# EAGLE schematic XMC4500_Relax-V1 (EAGLE 5.07)

## Sheet 1 of 2
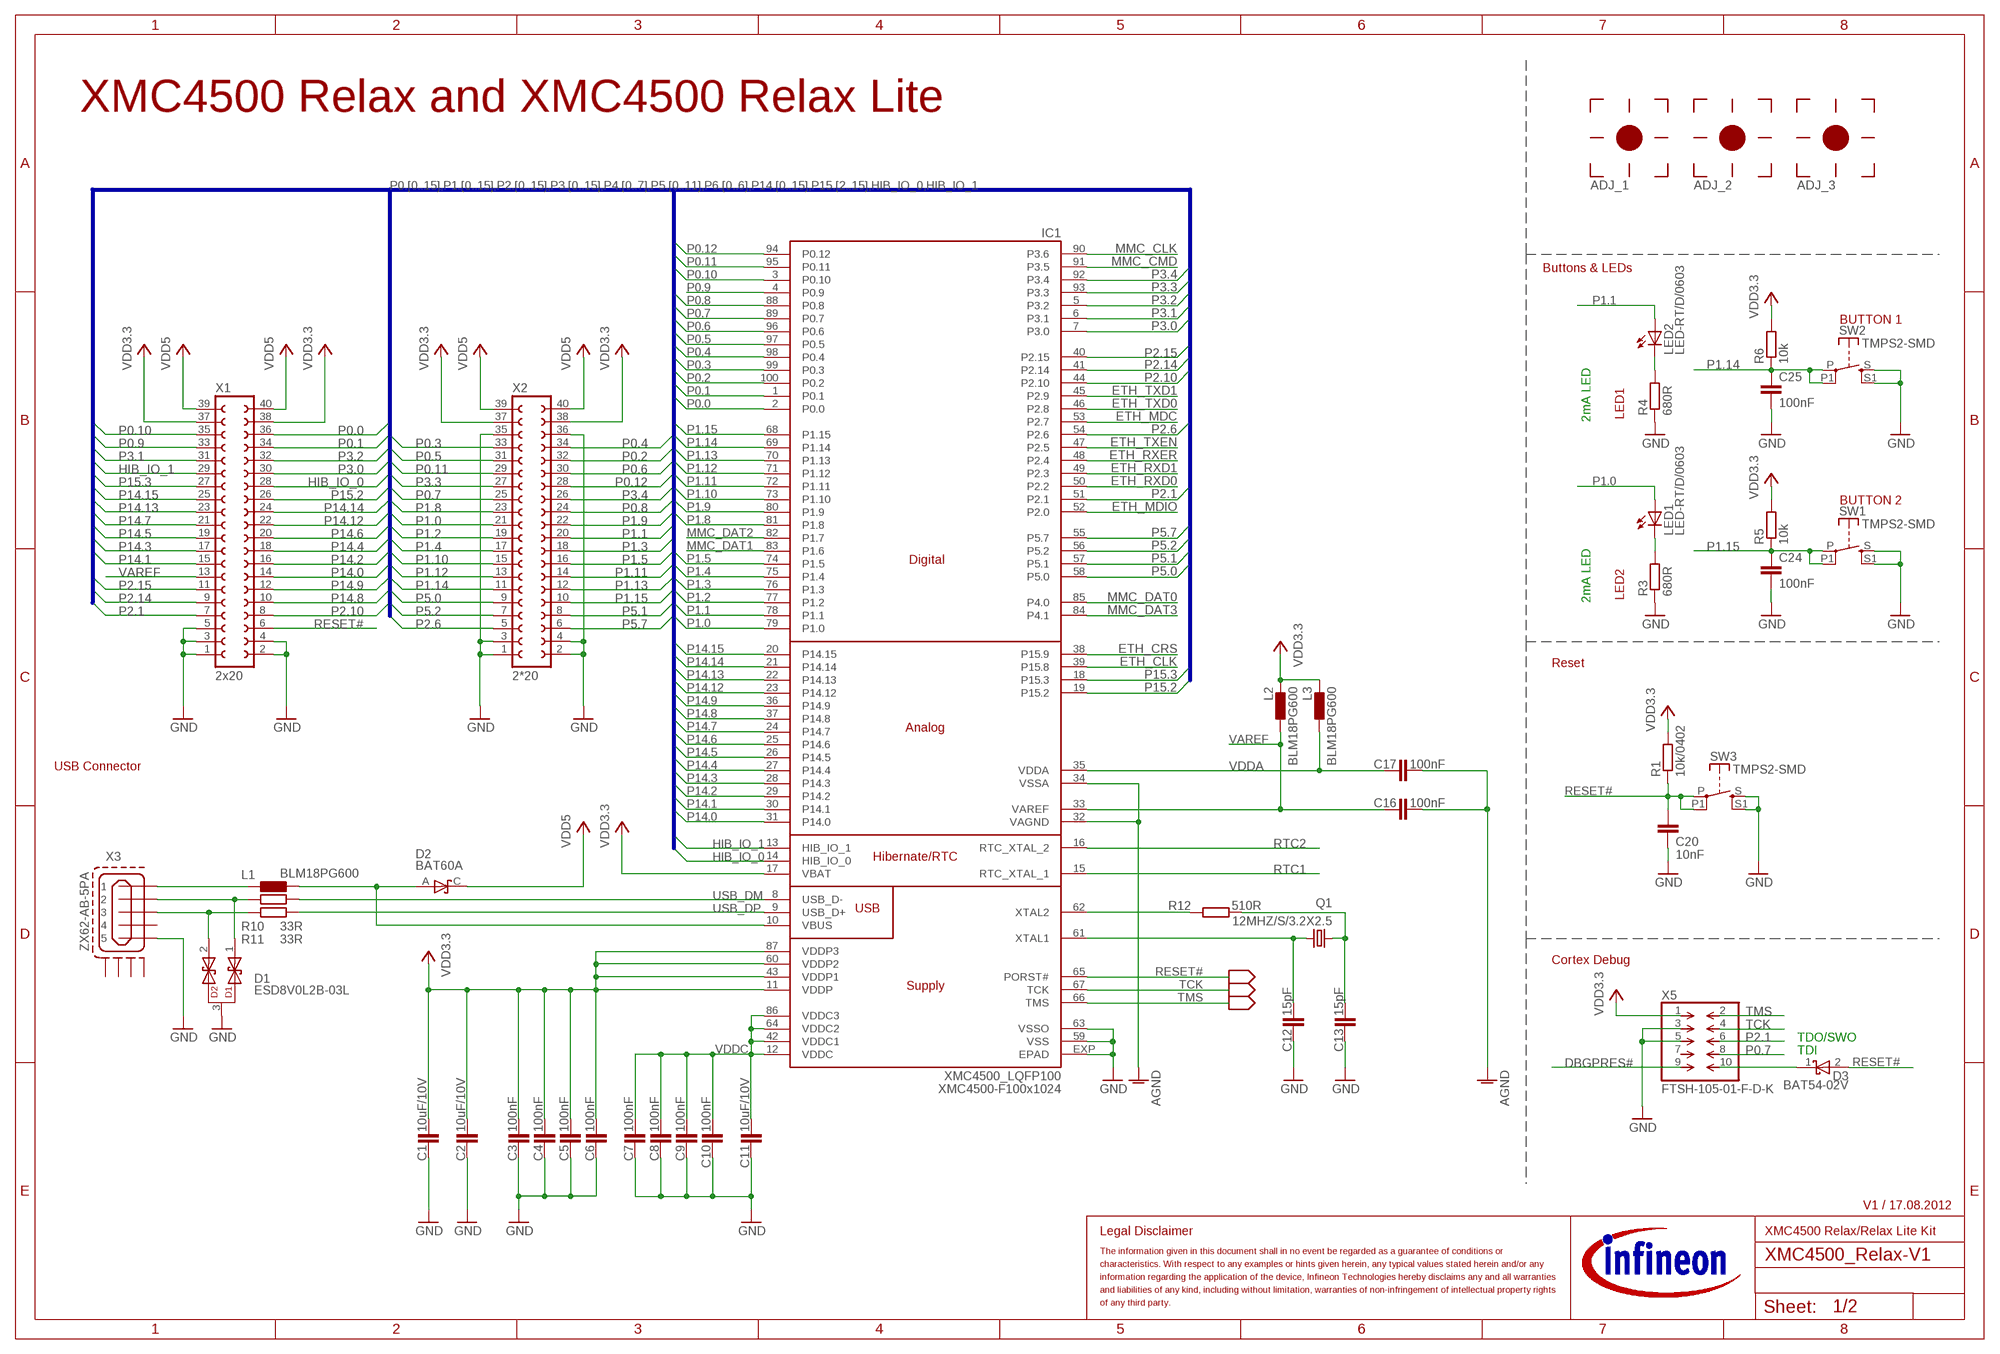
[diagram p0: schematic, sheet 1]

### Parts
ADJ_1  FIDUCIAL  [FIDUCIAL]
ADJ_2  FIDUCIAL  [FIDUCIAL]
ADJ_3  FIDUCIAL  [FIDUCIAL]
C1  10uF/10V  C-EUC0805K  [C0805K]
C2  10uF/10V  C-EUC0805K  [C0805K]
C3  100nF  C-EUC0402  [C0402]
C4  100nF  C-EUC0402  [C0402]
C5  100nF  C-EUC0402  [C0402]
C6  100nF  C-EUC0402  [C0402]
C7  100nF  C-EUC0402  [C0402]
C8  100nF  C-EUC0402  [C0402]
C9  100nF  C-EUC0402  [C0402]
C10  100nF  C-EUC0402  [C0402]
C11  10uF/10V  C-EUC0805K  [C0805K]
C12  15pF  C-EUC0402  [C0402]
C13  15pF  C-EUC0402  [C0402]
C16  100nF  C-EUC0402  [C0402]
C17  100nF  C-EUC0402  [C0402]
C20  10nF  C-EUC0402  [C0402]
C24  100nF  C-EUC0402  [C0402]
C25  100nF  C-EUC0402  [C0402]
D1  ESD8V0L2B-03L  [TSLP-3-1]
D2  BAT60A  BAT60  [SOD323-R]
D3  BAT54-02V  [SC79]
IC1  XMC4500_LQFP100  XMC4400_LQFP100  [P/PG-LQFP-100-11]
L1  BLM18PG600  L_EU_L0603  [L1608]
L2  BLM18PG600  L_EU_L0603  [L1608]
L3  BLM18PG600  L_EU_L0603  [L1608]
LED1  LED-RT/D/0603  LEDCHIPLED_0603  [CHIPLED_0603]
LED2  LED-RT/D/0603  LEDCHIPLED_0603  [CHIPLED_0603]
Q1  12MHZ/S/3.2X2.5  NX3225_2  [32X25_4PAD]
R1  10k/0402  R-EU_R0402  [R0402]
R3  680R  R-EU_R0603  [R0603]
R4  680R  R-EU_R0603  [R0603]
R5  10k  R-EU_R0402  [R0402]
R6  10k  R-EU_R0402  [R0402]
R10  33R  R-EU_R06030402  [R0402]
R11  33R  R-EU_R06030402  [R0402]
R12  510R  R-EU_R0603  [R0603]
SW1  TMPS2-SMD  FSM2JSMA  [FSM2JSMA]
SW2  TMPS2-SMD  FSM2JSMA  [FSM2JSMA]
SW3  TMPS2-SMD  FSM2JSMA  [FSM2JSMA]
X1  2x20  FE20-2  [FE20-2]
X2  2*20  FE20-2  [FE20-2]
X3  ZX62-AB-5PA  ZX62-AB-5PA_MICRO-USB  [ZX62-AB-5PA_MICRO-USB]
X5  FTSH-105-01-F-D-K  [FTSH-105-01-F-D-K]

### Nets
AGND: C16.2 C17.2 IC1.32(VAGND) IC1.34(VSSA)
DBGPRES#: X5.9 ; also sheet 2
ETH_CLK: IC1.39(P15.8) ; also sheet 2
ETH_CRS: IC1.38(P15.9) ; also sheet 2
ETH_MDC: IC1.53(P2.7) ; also sheet 2
ETH_MDIO: IC1.52(P2.0) ; also sheet 2
ETH_RXD0: IC1.50(P2.2) ; also sheet 2
ETH_RXD1: IC1.49(P2.3) ; also sheet 2
ETH_RXER: IC1.48(P2.4) ; also sheet 2
ETH_TXD0: IC1.46(P2.8) ; also sheet 2
ETH_TXD1: IC1.45(P2.9) ; also sheet 2
ETH_TXEN: IC1.47(P2.5) ; also sheet 2
GND: C1.2 C2.2 C3.2 C4.2 C5.2 C6.2 C7.2 C8.2 C9.2 C10.2 C11.2 C12.2 C13.2 C20.2 C24.2 C25.2 D1.3 IC1.59(VSS) IC1.63(VSSO) IC1.EXP(EPAD) R3.1 R4.1 SW1.S SW1.S1(S) SW2.S SW2.S1(S) SW3.S SW3.S1(S) X1.1 X1.2 X1.3 X1.4 X1.5 X2.1 X2.2 X2.3 X2.4 X2.35 X2.36 X3.5 X5.3 X5.5 ; also sheet 2
HIB_IO_0: IC1.14(HIB_IO_0) X1.28
HIB_IO_1: IC1.13(HIB_IO_1) X1.29
MMC_CLK: IC1.90(P3.6) ; also sheet 2
MMC_CMD: IC1.91(P3.5) ; also sheet 2
MMC_DAT0: IC1.85(P4.0) ; also sheet 2
MMC_DAT1: IC1.83(P1.6) ; also sheet 2
MMC_DAT2: IC1.82(P1.7) ; also sheet 2
MMC_DAT3: IC1.84(P4.1) ; also sheet 2
N$4: LED1.C R3.2
N$5: LED2.C R4.2
N$6: IC1.62(XTAL2) R12.1
N$7: C13.1 Q1.3 R12.2
N$8: C12.1 IC1.61(XTAL1) Q1.1
N$11: L1.2 X3.1
N$13: D1.1 R10.1 X3.2
N$23: D2.A IC1.10(VBUS) L1.1
N$26: D3.1(C) X5.10
N$36: D1.2 R11.1 X3.3
P0.0: IC1.2(P0.0) X1.36 ; also sheet 2
P0.1: IC1.1(P0.1) X1.34 ; also sheet 2
P0.2: IC1.100(P0.2) X2.32
P0.3: IC1.99(P0.3) X2.33
P0.4: IC1.98(P0.4) X2.34
P0.5: IC1.97(P0.5) X2.31
P0.6: IC1.96(P0.6) X2.30
P0.7: IC1.89(P0.7) X2.25 X5.8 ; also sheet 2
P0.8: IC1.88(P0.8) X2.24
P0.9: IC1.4(P0.9) X1.33
P0.10: IC1.3(P0.10) X1.35
P0.11: IC1.95(P0.11) X2.29
P0.12: IC1.94(P0.12) X2.28
P1.0: IC1.79(P1.0) LED1.A X2.21
P1.1: IC1.78(P1.1) LED2.A X2.20
P1.2: IC1.77(P1.2) X2.19 ; also sheet 2
P1.3: IC1.76(P1.3) X2.18 ; also sheet 2
P1.4: IC1.75(P1.4) X2.17 ; also sheet 2
P1.5: IC1.74(P1.5) X2.16 ; also sheet 2
P1.8: IC1.81(P1.8) X2.23 ; also sheet 2
P1.9: IC1.80(P1.9) X2.22
P1.10: IC1.73(P1.10) X2.15 ; also sheet 2
P1.11: IC1.72(P1.11) X2.14
P1.12: IC1.71(P1.12) X2.13
P1.13: IC1.70(P1.13) X2.12
P1.14: C25.1 IC1.69(P1.14) R6.1 SW2.P SW2.P1(P) X2.11
P1.15: C24.1 IC1.68(P1.15) R5.1 SW1.P SW1.P1(P) X2.10
P2.1: IC1.51(P2.1) X1.7 X5.6 ; also sheet 2
P2.6: IC1.54(P2.6) X2.5
P2.10: IC1.44(P2.10) X1.8 ; also sheet 2
P2.14: IC1.41(P2.14) X1.9
P2.15: IC1.40(P2.15) X1.11
P3.0: IC1.7(P3.0) X1.30
P3.1: IC1.6(P3.1) X1.31 ; also sheet 2
P3.2: IC1.5(P3.2) X1.32
P3.3: IC1.93(P3.3) X2.27
P3.4: IC1.92(P3.4) X2.26
P5.0: IC1.58(P5.0) X2.9
P5.1: IC1.57(P5.1) X2.8
P5.2: IC1.56(P5.2) X2.7
P5.7: IC1.55(P5.7) X2.6
P14.0: IC1.31(P14.0) X1.14
P14.1: IC1.30(P14.1) X1.15
P14.2: IC1.29(P14.2) X1.16
P14.3: IC1.28(P14.3) X1.17
P14.4: IC1.27(P14.4) X1.18
P14.5: IC1.26(P14.5) X1.19
P14.6: IC1.25(P14.6) X1.20
P14.7: IC1.24(P14.7) X1.21
P14.8: IC1.37(P14.8) X1.10
P14.9: IC1.36(P14.9) X1.12
P14.12: IC1.23(P14.12) X1.22
P14.13: IC1.22(P14.13) X1.23
P14.14: IC1.21(P14.14) X1.24
P14.15: IC1.20(P14.15) X1.25
P15.2: IC1.19(P15.2) X1.26
P15.3: IC1.18(P15.3) X1.27
RESET#: C20.1 D3.2(A) IC1.65(PORST#) R1.1 SW3.P SW3.P1(P) X1.6 ; also sheet 2
RTC1: IC1.15(RTC_XTAL_1) ; also sheet 2
RTC2: IC1.16(RTC_XTAL_2) ; also sheet 2
TCK: IC1.67(TCK) X5.4 ; also sheet 2
TMS: IC1.66(TMS) X5.2 ; also sheet 2
USB_DM: IC1.8(USB_D-) R10.2
USB_DP: IC1.9(USB_D+) R11.2
VAREF: C16.1 IC1.33(VAREF) L2.1 X1.13
VDD3.3: C1.1 C2.1 C3.1 C4.1 C5.1 C6.1 IC1.11(VDDP) IC1.17(VBAT) IC1.43(VDDP1) IC1.60(VDDP2) IC1.87(VDDP3) L2.2 L3.2 R1.2 R5.2 R6.2 X1.37 X1.38 X2.37 X2.38 X5.1 ; also sheet 2
VDD5: D2.C X1.39 X1.40 X2.39 X2.40 ; also sheet 2
VDDA: C17.1 IC1.35(VDDA) L3.1
VDDC: C7.1 C8.1 C9.1 C10.1 C11.1 IC1.12(VDDC) IC1.42(VDDC1) IC1.64(VDDC2) IC1.86(VDDC3)
Unconnected: X3.4 X3.S1(S:S1) X3.S2(S:S2) X3.S3(S:S3) X3.S4(S:S4) X5.7

### Buses
P0.[0..15],P1.[0..15],P2.[0..15],P3.[0..15],P4.[0..7],P5.[0..11],P6.[0..6],P14.[0..15],P15.[2..15],HIB_IO_0,HIB_IO_1,RESET#
P0.[0..15],P1.[0..15],P2.[0..15],P3.[0..15],P4.[0..7],P5.[0..11],P6.[0..6],P14.[0..15],P15.[2..15],HIB_IO_0,HIB_IO_1

### Notes on the sheet
- XMC4500 Relax and XMC4500 Relax Lite
- Buttons & LEDs
- BUTTON 1
- 2mA LED | LED1
- BUTTON 2
- 2mA LED | LED2
- Reset
- USB Connector
- X3
- Cortex Debug
- TDO/SWO
- TDI
- XMC4500-F100x1024
- V1 / 17.08.2012
- XMC4500 Relax/Relax Lite Kit

## Sheet 2 of 2
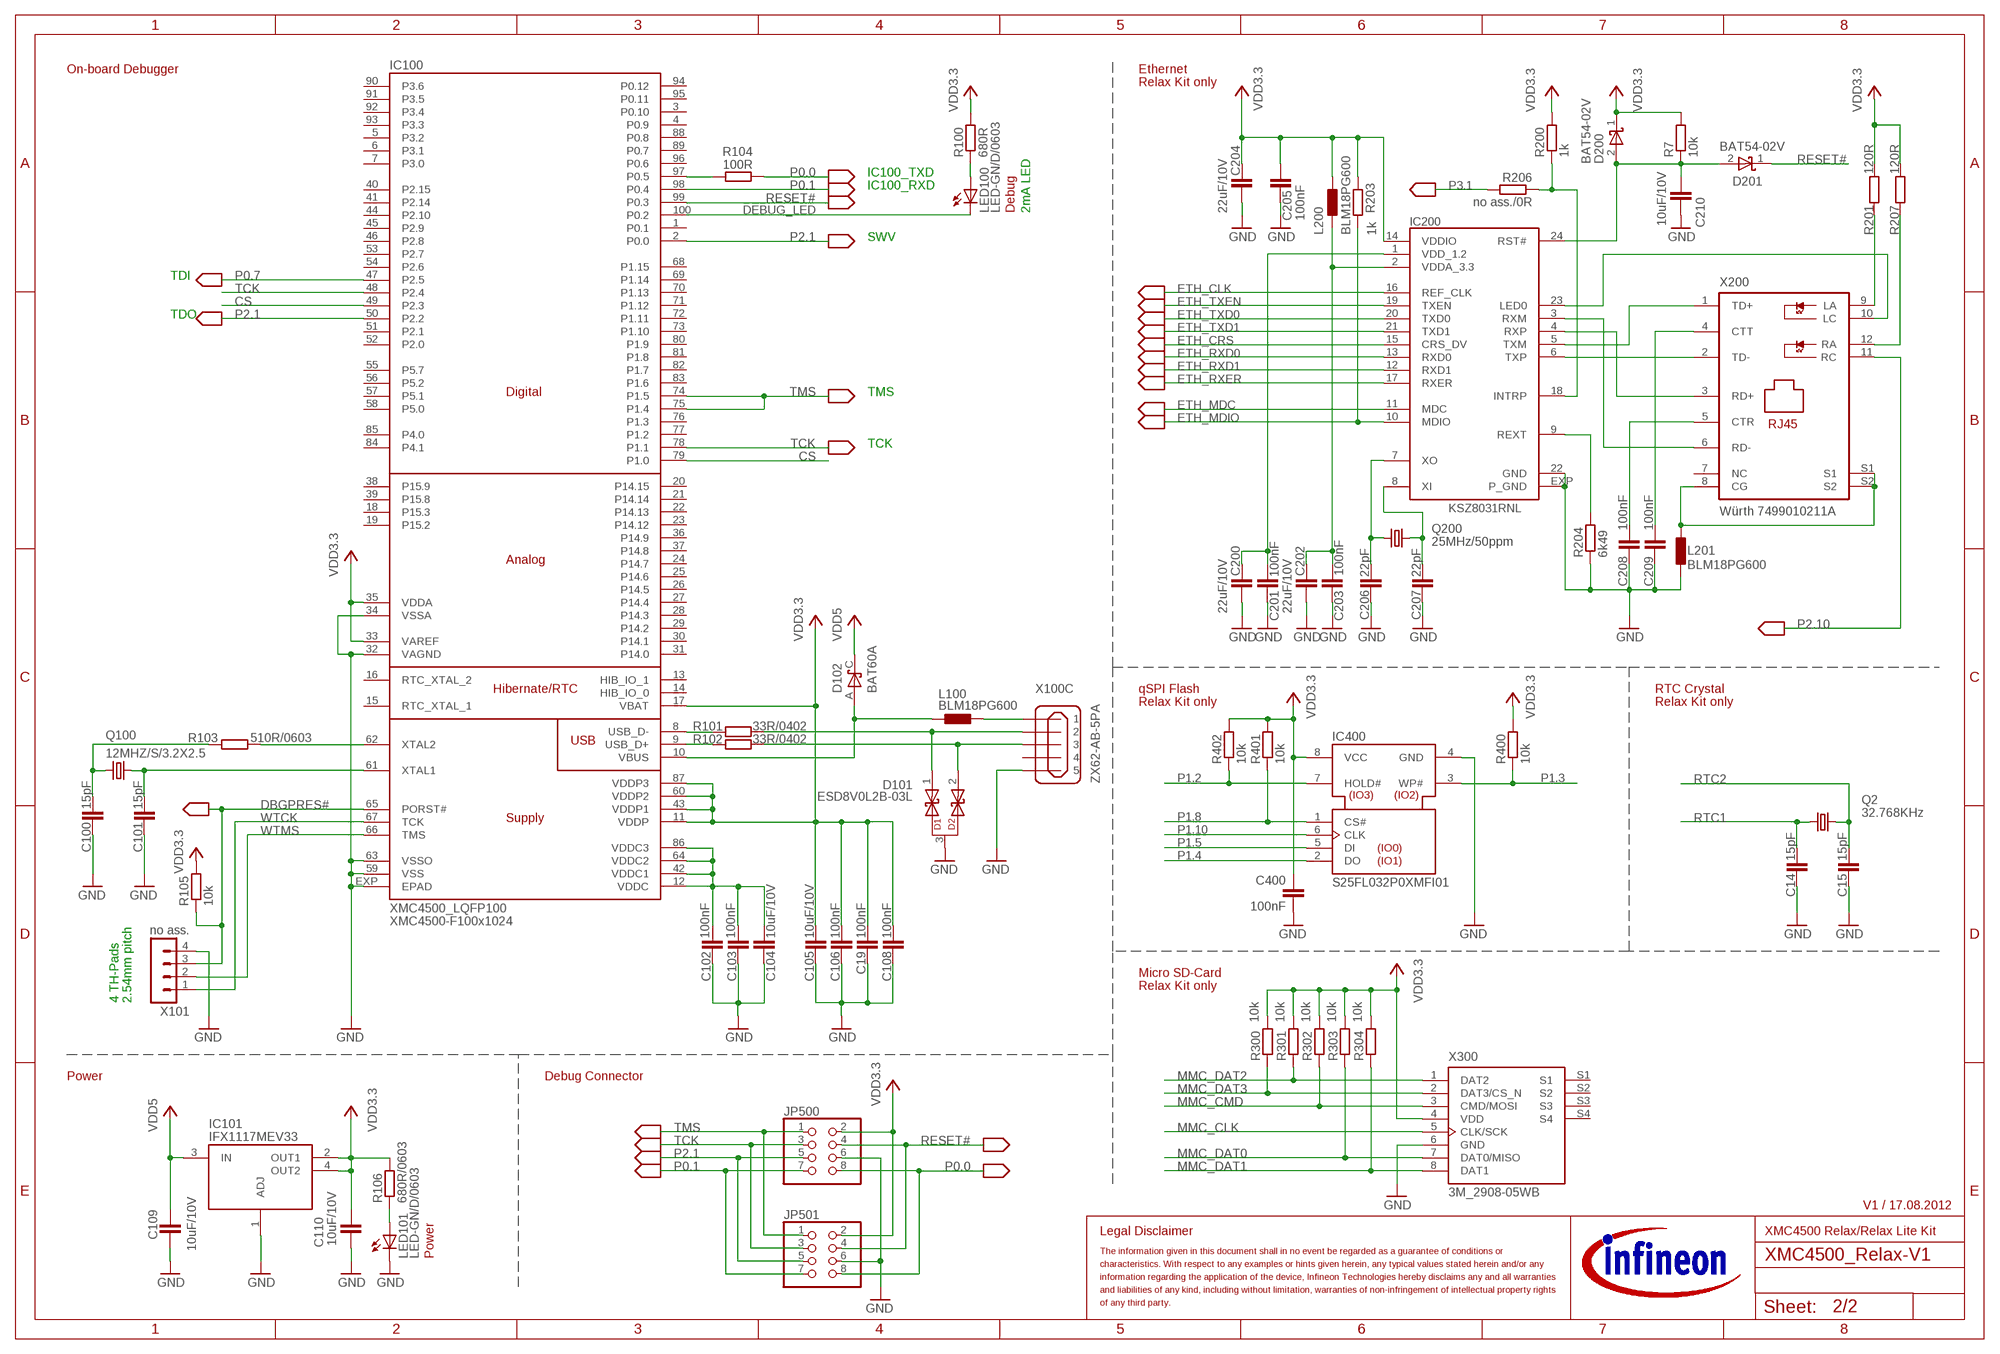
[diagram p1: schematic, sheet 2]

### Parts
C14  15pF  C-EUC0402  [C0402]
C15  15pF  C-EUC0402  [C0402]
C19  100nF  C-EUC0402  [C0402]
C100  15pF  C-EUC0402  [C0402]
C101  15pF  C-EUC0402  [C0402]
C102  100nF  C-EUC0402  [C0402]
C103  100nF  C-EUC0402  [C0402]
C104  10uF/10V  C-EUC0805K  [C0805K]
C105  10uF/10V  C-EUC0805K  [C0805K]
C106  100nF  C-EUC0402  [C0402]
C108  100nF  C-EUC0402  [C0402]
C109  10uF/10V  C-EUC0805K  [C0805K]
C110  10uF/10V  C-EUC0805K  [C0805K]
C200  22uF/10V  C-EUC0805K  [C0805K]
C201  100nF  C-EUC0402  [C0402]
C202  22uF/10V  C-EUC0805K  [C0805K]
C203  100nF  C-EUC0402  [C0402]
C204  22uF/10V  C-EUC0805K  [C0805K]
C205  100nF  C-EUC0402  [C0402]
C206  22pF  C-EUC0402  [C0402]
C207  22pF  C-EUC0402  [C0402]
C208  100nF  C-EUC0402  [C0402]
C209  100nF  C-EUC0402  [C0402]
C210  10uF/10V  C-EUC0805K  [C0805K]
C400  100nF  C-EUC0402  [C0402]
D101  ESD8V0L2B-03L  [TSLP-3-1]
D102  BAT60A  BAT60  [SOD323-R]
D200  BAT54-02V  [SC79]
D201  BAT54-02V  [SC79]
IC100  XMC4500_LQFP100  XMC4400_LQFP100  [P/PG-LQFP-100-11]
IC101  IFX1117MEV33  IFX1117  [SOT223]
IC200  KSZ8031RNL  [QFN24]
IC400  S25FL032P0XMFI01  W25Q80BVSSIG  [SO08W]
JP500  PINHD-2X4  [2X04]
JP501  PINHD-2X4  [2X04]
L100  BLM18PG600  L_EU_L0603  [L1608]
L200  BLM18PG600  L_EU_L0603  [L1608]
L201  BLM18PG600  L_EU_L0603  [L1608]
LED100  LED-GN/D/0603  LEDCHIPLED_0603  [CHIPLED_0603]
LED101  LED-GN/D/0603  LEDCHIPLED_0603  [CHIPLED_0603]
Q2  32.768KHz  MC-306  [SMD4_270]
Q100  12MHZ/S/3.2X2.5  NX3225_2  [32X25_4PAD]
Q200  25MHz/50ppm  NX3225_2  [32X25_4PAD]
R7  10k  R-EU_R0402  [R0402]
R100  680R  R-EU_R0603  [R0603]
R101  33R/0402  R-EU_R0402  [R0402]
R102  33R/0402  R-EU_R0402  [R0402]
R103  510R/0603  R-EU_R0603  [R0603]
R104  100R  R-EU_R0402  [R0402]
R105  10k  R-EU_R0402  [R0402]
R106  680R/0603  R-EU_R0603  [R0603]
R200  1k  R-EU_R0603  [R0603]
R201  120R  R-EU_R0603  [R0603]
R203  1k  R-EU_R0603  [R0603]
R204  6k49  R-EU_R0603  [R0603]
R206  no ass./0R  R-EU_R0603  [R0603]
R207  120R  R-EU_R0603  [R0603]
R300  10k  R-EU_R0402  [R0402]
R301  10k  R-EU_R0402  [R0402]
R302  10k  R-EU_R0402  [R0402]
R303  10k  R-EU_R0402  [R0402]
R304  10k  R-EU_R0402  [R0402]
R400  10k  R-EU_R0402  [R0402]
R401  10k  R-EU_R0402  [R0402]
R402  10k  R-EU_R0402  [R0402]
X100  ZX62-AB-5PA  ZX62-AB-5PA_MICRO-USB  [ZX62-AB-5PA_MICRO-USB]
X101  no ass.  MA04-1  [MA04-1]
X200  Würth 7499010211A  J0011D01B  [J0-A/B/F]
X300  3M_2908-05WB  [3M_MICRO-SD_SLOT]

### Nets
CS: IC100.49(P2.3) IC100.79(P1.0)
DBGPRES#: IC100.65(PORST#) R105.1 X101.3 ; also sheet 1
DEBUG_LED: IC100.100(P0.2) LED100.C
ETH_CLK: IC200.16(REF_CLK) ; also sheet 1
ETH_CRS: IC200.15(CRS_DV) ; also sheet 1
ETH_MDC: IC200.11(MDC) ; also sheet 1
ETH_MDIO: IC200.10(MDIO) R203.2 ; also sheet 1
ETH_RXD0: IC200.13(RXD0) ; also sheet 1
ETH_RXD1: IC200.12(RXD1) ; also sheet 1
ETH_RXER: IC200.17(RXER) ; also sheet 1
ETH_TXD0: IC200.20(TXD0) ; also sheet 1
ETH_TXD1: IC200.21(TXD1) ; also sheet 1
ETH_TXEN: IC200.19(TXEN) ; also sheet 1
GND: C14.2 C15.2 C19.2 C100.2 C101.2 C102.2 C103.2 C104.2 C105.2 C106.2 C108.2 C109.2 C110.2 C200.2 C201.2 C202.2 C203.2 C204.2 C205.2 C206.2 C207.2 C208.2 C209.2 C210.2 C400.2 D101.3 IC100.32(VAGND) IC100.34(VSSA) IC100.59(VSS) IC100.63(VSSO) IC100.EXP(EPAD) IC101.1(ADJ) IC200.22(GND) IC200.EXP(P_GND) IC400.4(GND) JP500.6 JP501.6 L201.2 LED101.C R204.1 X100.5 X101.4 X300.6(GND) ; also sheet 1
MMC_CLK: X300.5(CLK/SCK) ; also sheet 1
MMC_CMD: R302.1 X300.3(CMD/MOSI) ; also sheet 1
MMC_DAT0: R303.1 X300.7(DAT0/MISO) ; also sheet 1
MMC_DAT1: R304.1 X300.8(DAT1) ; also sheet 1
MMC_DAT2: R301.1 X300.1(DAT2) ; also sheet 1
MMC_DAT3: R300.1 X300.2(DAT3/CS_N) ; also sheet 1
N$1: L100.2 X100.1
N$2: R207.1 X200.12(RA)
N$3: LED100.A R100.1
N$15: IC200.5(TXM) X200.1(TD+)
N$16: LED101.A R106.1
N$17: R201.1 X200.9(LA)
N$18: IC200.23(LED0) X200.10(LC)
N$19: L201.1 X200.8(CG) X200.S1 X200.S2
N$21: C210.1 D200.2(A) D201.2(A) IC200.24(RST#) R7.1
N$40: D101.1 R101.2 X100.2
N$41: D101.2 R102.2 X100.3
N$43: C100.1 Q100.3 R103.2
N$47: D102.A IC100.10(VBUS) L100.1
N$50: IC200.6(TXP) X200.2(TD-)
N$51: IC200.4(RXP) X200.3(RD+)
N$52: IC200.3(RXM) X200.6(RD-)
N$53: C209.1 X200.4(CTT)
N$54: C208.1 X200.5(CTR)
N$55: IC200.9(REXT) R204.2
N$58: C207.1 IC200.8(XI) Q200.3
N$59: C206.1 IC200.7(XO) Q200.1
N$69: C202.1 C203.1 IC200.2(VDDA_3.3) L200.2
N$70: C200.1 C201.1 IC200.1(VDD_1.2)
P0.0: JP500.8 JP501.8 R104.2 ; also sheet 1
P0.1: IC100.98(P0.4) JP500.7 JP501.7 ; also sheet 1
P0.7: IC100.47(P2.5) ; also sheet 1
P1.2: IC400.7(HOLD#) R402.1 ; also sheet 1
P1.3: IC400.3(WP#) R400.1 ; also sheet 1
P1.4: IC400.2(DO) ; also sheet 1
P1.5: IC400.5(DI) ; also sheet 1
P1.8: IC400.1(CS#) R401.1 ; also sheet 1
P1.10: IC400.6(CLK) ; also sheet 1
P2.1: IC100.2(P0.0) IC100.50(P2.2) JP500.5 JP501.5 ; also sheet 1
P2.10: X200.11(RC) ; also sheet 1
P3.1: R206.2 ; also sheet 1
P3.1_S: IC200.18(INTRP) R200.1 R206.1
RESET#: D201.1(C) IC100.99(P0.3) JP500.4 JP501.4 ; also sheet 1
RTC1: C14.1 Q2.4 ; also sheet 1
RTC2: C15.1 Q2.1 ; also sheet 1
TCK: IC100.48(P2.4) IC100.78(P1.1) JP500.3 JP501.3 ; also sheet 1
TMS: IC100.74(P1.5) IC100.75(P1.4) JP500.1 JP501.1 ; also sheet 1
TXD: IC100.97(P0.5) R104.1
VDD3.3: C19.1 C105.1 C106.1 C108.1 C110.1 C204.1 C205.1 C400.1 D200.1(C) IC100.11(VDDP) IC100.17(VBAT) IC100.33(VAREF) IC100.35(VDDA) IC100.43(VDDP1) IC100.60(VDDP2) IC100.87(VDDP3) IC101.2(OUT1) IC101.4(OUT2) IC200.14(VDDIO) IC400.8(VCC) JP500.2 JP501.2 L200.1 R7.2 R100.2 R105.2 R106.2 R200.2 R201.2 R203.1 R207.2 R300.2 R301.2 R302.2 R303.2 R304.2 R400.2 R401.2 R402.2 X300.4(VDD) ; also sheet 1
VDD5: C109.1 D102.C IC101.3(IN) ; also sheet 1
WTCK: IC100.67(TCK) X101.1
WTMS: IC100.66(TMS) X101.2
WUSB_DM: IC100.8(USB_D-) R101.1
WUSB_DP: IC100.9(USB_D+) R102.1
WVDDC: C102.1 C103.1 C104.1 IC100.12(VDDC) IC100.42(VDDC1) IC100.64(VDDC2) IC100.86(VDDC3)
WXTAL1: C101.1 IC100.61(XTAL1) Q100.1
WXTAL2: IC100.62(XTAL2) R103.1
Unconnected: IC100.1(P0.1) IC100.3(P0.10) IC100.4(P0.9) IC100.5(P3.2) IC100.6(P3.1) IC100.7(P3.0) IC100.13(HIB_IO_1) IC100.14(HIB_IO_0) IC100.15(RTC_XTAL_1) IC100.16(RTC_XTAL_2) IC100.18(P15.3) IC100.19(P15.2) IC100.20(P14.15) IC100.21(P14.14) IC100.22(P14.13) IC100.23(P14.12) IC100.24(P14.7) IC100.25(P14.6) IC100.26(P14.5) IC100.27(P14.4) IC100.28(P14.3) IC100.29(P14.2) IC100.30(P14.1) IC100.31(P14.0) IC100.36(P14.9) IC100.37(P14.8) IC100.38(P15.9) IC100.39(P15.8) IC100.40(P2.15) IC100.41(P2.14) IC100.44(P2.10) IC100.45(P2.9) IC100.46(P2.8) IC100.51(P2.1) IC100.52(P2.0) IC100.53(P2.7) IC100.54(P2.6) IC100.55(P5.7) IC100.56(P5.2) IC100.57(P5.1) IC100.58(P5.0) IC100.68(P1.15) IC100.69(P1.14) IC100.70(P1.13) IC100.71(P1.12) IC100.72(P1.11) IC100.73(P1.10) IC100.76(P1.3) IC100.77(P1.2) IC100.80(P1.9) IC100.81(P1.8) IC100.82(P1.7) IC100.83(P1.6) IC100.84(P4.1) IC100.85(P4.0) IC100.88(P0.8) IC100.89(P0.7) IC100.90(P3.6) IC100.91(P3.5) IC100.92(P3.4) IC100.93(P3.3) IC100.94(P0.12) IC100.95(P0.11) IC100.96(P0.6) X100.4 X100.S1(S:S1) X100.S2(S:S2) X100.S3(S:S3) X100.S4(S:S4) X200.7(NC) X300.S1 X300.S2 X300.S3 X300.S4

### Notes on the sheet
- On-board Debugger | Ethernet
- Relax Kit only
- IC100_TXD
- IC100_RXD
- Debug | 2mA LED
- IC200
- SWV
- TDI
- TDO
- TMS
- TCK
- KSZ8031RNL
- qSPI Flash | RTC Crystal
- Relax Kit only | Relax Kit only
- XMC4500-F100x1024
- Micro SD-Card
- Relax Kit only
- 4 TH-Pads | 2.54mm pitch
- Power | Debug Connector
- V1 / 17.08.2012
- XMC4500 Relax/Relax Lite Kit
- Power

## Library data of the parts
ADJ_1-ADJ_3 = Global:FIDUCIAL
C1 C2 C11 C104 C105 C109 C110 C200 C202 C204 C210 = HMI_OLED-V1:C-EU: CAPACITOR, European symbol
C3-C10 C12-C17 C19 C20 C24 C25 C100-C103 C106 C108 C201 C203 C205-C209 C400 = DsC:C-EUC0402
D1 D101 = DsDiod:ESD8V0L2B-03L
D2 D102 = BAT60:BAT60; A: A; B: B
D3 D200 D201 = DsDiod:BAT54-02V
IC1 IC100 = XMC4000_v4.16:XMC4400_LQFP100
IC101 = IvregL:IFX1117
IC200 = micrelphy:KSZ8031RNL: Ethernet PHY
IC400 = IMFRom:W25Q80BV
JP500 JP501 = pinhead:PINHD-2X4: PIN HEADER
L1-L3 L100 L200 L201 = PDFerr:L_EU_
LED1 LED2 LED100 LED101 = led:LED: LED OSRAM: - CHIPLED LG R971, LG N971, LY N971, LG Q971, LY Q971, LO R971, LY R971 LH N974, LH R974 LS Q976, LO Q976, LY Q976 LO Q996 - Hyper CHIPLED LW Q18S LB Q993, LB Q99A, LB R99A - SideLED LS A670, LO A670, LY A670, LG A670, LP A670 LB A673, LV A673, LT A673, LW A673 LH A674 LY A675 LS A676, LA A676, LO A676, LY A676, LW A676 LS A679, LY A679, LG A679 - Hyper Micro SIDELED® LS Y876, LA Y876, LO Y876, LY Y876 LT Y87S - SmartLED LW L88C, LW L88S LB L89C, LB L89S, LG L890 LS L89K, LO L89K, LY L89K LS L896, LA L896, LO L896, LY L896 - TOPLED LS T670, LO T670, LY T670, LG T670, LP T670 LSG T670, LSP T670, LSY T670, LOP T670, LYG T670 LG T671, LOG T671, LSG T671 LB T673, LV T673, LT T673, LW T673 LH T674 LS T676, LA T676, LO T676, LY T676, LB T676, LH T676, LSB T676, LW T676 LB T67C, LV T67C, LT T67C, LS T67K, LO T67K, LY T67K, LW E67C LS E67B, LA E67B, LO E67B, LY E67B, LB E67C, LV E67C, LT E67C LW T67C LS T679, LY T679, LG T679 LS T770, LO T770, LY T770, LG T770, LP T770 LB T773, LV T773, LT T773, LW T773 LH T774 LS E675, LA E675, LY E675, LS T675 LS T776, LA T776, LO T776, LY T776, LB T776 LHGB T686 LT T68C, LB T68C - Hyper Mini TOPLED® LB M676 - Mini TOPLED Santana® LG M470 LS M47K, LO M47K, LY M47K Source: http://www.osram.convergy.de - LUMILED® LXK2-PW12-R00, LXK2-PW12-S00, LXK2-PW14-U00, LXK2-PW14-V00 LXK2-PM12-R00, LXK2-PM12-S00, LXK2-PM14-U00 LXK2-PE12-Q00, LXK2-PE12-R00, LXK2-PE12-S00, LXK2-PE14-T00, LXK2-PE14-U00 LXK2-PB12-K00, LXK2-PB12-L00, LXK2-PB12-M00, LXK2-PB14-N00, LXK2-PB14-P00, LXK2-PB14-Q00 LXK2-PR12-L00, LXK2-PR12-M00, LXK2-PR14-Q00, LXK2-PR14-R00 LXK2-PD12-Q00, LXK2-PD12-R00, LXK2-PD12-S00 LXK2-PH12-R00, LXK2-PH12-S00 LXK2-PL12-P00, LXK2-PL12-Q00, LXK2-PL12-R00 Source: www.luxeon.com
Q1 Q100 Q200 = Quarz:NX3225_2
Q2 = DsQuarz:MC-306
R1 R5-R7 R101 R102 R104 R105 R300-R304 R400-R402 = DsR:R-EU_R0402
R3 R4 R10-R12 R100 R103 R106 R200 R201 R203 R204 R206 R207 = DsR:R-EU_R0603
SW1-SW3 = MSwitch:FSM2JSMA
X1 X2 = con-lsta:FE20-2: FEMALE HEADER
X3 X100 = XSRRND:ZX62-AB-5PA_MICRO-USB
X5 = Xtv127:FTSH-105-01-F-D-K
X101 = XTV254:MA04-1
X200 = pulse-eng:J0011D01B: RJ45 PulseJack w/LEDs
X300 = HMI_OLED-V1:3M_2908-05WB